# Altium schematic sheet USB.SchDoc
size A; SheetNumber: 2; SheetTotal: 8
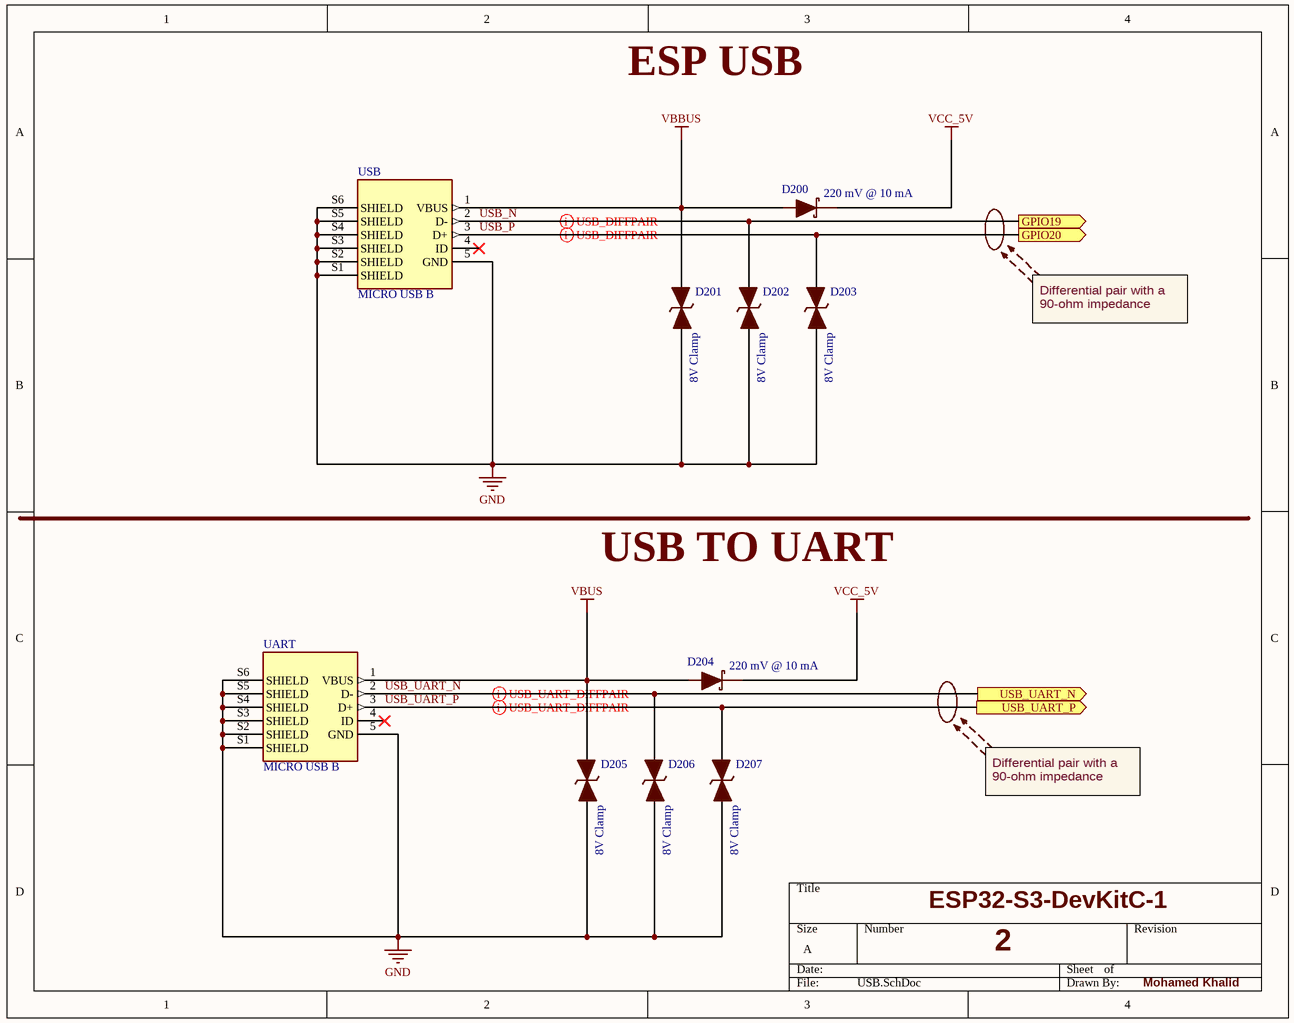
[diagram p0: USB.SchDoc]

## Parts
D200  220 mV @ 10 mA  [SODFL1608X70N]
D201  8V Clamp  [SODFL1006X40N]
D202  8V Clamp  [SODFL1006X40N]
D203  8V Clamp  [SODFL1006X40N]
D204  220 mV @ 10 mA  [SODFL1608X70N]
D205  8V Clamp  [SODFL1006X40N]
D206  8V Clamp  [SODFL1006X40N]
D207  8V Clamp  [SODFL1006X40N]
UART  MICRO USB B  [AMPHENOL_10118193-0001LF]
USB  MICRO USB B  [AMPHENOL_10118193-0001LF]

## Ports
GPIO19 (out, see ESP32-S3-WROOM-1U[2C], PIN-HEADERS[2B]), GPIO20 (out, see ESP32-S3-WROOM-1U[2C], PIN-HEADERS[2B]), USB_UART_N (out, see USB_TO_UART_CONVERTER[1B]), USB_UART_P (out, see USB_TO_UART_CONVERTER[1B])

## Nets
GND: D201.1 D202.1 D203.1 D205.1 D206.1 D207.1 UART.5(GND) UART.S1(SHIELD) UART.S2(SHIELD) UART.S3(SHIELD) UART.S4(SHIELD) UART.S5(SHIELD) UART.S6(SHIELD) USB.5(GND) USB.S1(SHIELD) USB.S2(SHIELD) USB.S3(SHIELD) USB.S4(SHIELD) USB.S5(SHIELD) USB.S6(SHIELD)
VBBUS: D200.1(K) D201.2 USB.1(VBUS)
VBUS: D204.1(K) D205.2 UART.1(VBUS)
VCC_5V: D200.2(A) D204.2(A)
USB_N: D202.2 USB.2(D-) ; port GPIO19
USB_P: D203.2 USB.3(D+) ; port GPIO20
USB_UART_N: D206.2 UART.2(D-) ; port USB_UART_N
USB_UART_P: D207.2 UART.3(D+) ; port USB_UART_P

Not connected (* = marked no-connect by the designer): UART 4(ID)*; USB 4(ID)*

## Layout directives
differential pair; differential pair class USB_UART_DIFF: USB_UART_N, USB_UART_P
differential pair; differential pair class USB_DIFF: USB_N, USB_P

## Notes on the sheet
- ESP USB
- Differential pair with a 90-ohm impedance
- USB TO UART
- ESP32-S3-DevKitC-1
- 2
- Mohamed Khalid

## Library data of the parts
D200 D204 = CFSH05-20L TR PBFREE: Diode 20 V 500mA Surface Mount SOD-882; Current - Reverse Leakage @ Vr: 8 µA @ 10 V; Voltage - DC Reverse (Vr) (Max): 20 V; Voltage - Forward (Vf) (Max) @ If: 220 mV @ 10 mA
D201-D203 D205-D207 = ESDZV5-1BU2: 8V (Typ) Clamp 7A (8/20µs) Ipp Tvs Diode Surface Mount 0201; Voltage - Reverse Standoff (Typ): 5.5V (Max); Voltage - Breakdown (Min): 5.8V; Voltage - Clamping (Max) @ Ipp: 8V (Typ)
UART USB = 10118193-0001LF: Right Angle Surface Mount Mount Female USB Connector 100 V ac 1.8A | Amphenol FCI (Amphenol CS) 10118193-0001LF; Specifications: USB 2.0; MF: Amphenol ICC; SnapEDA_Link: https://www.snapeda.com/parts/10118193-0001LF/Amphenol+FCI/view-part/?ref=snap; Package: None; MP: 10118193-0001LF; Check_prices: https://www.snapeda.com/parts/10118193-0001LF/Amphenol+FCI/view-part/?ref=eda